# EAGLE design hemera_C (EAGLE 5.10)
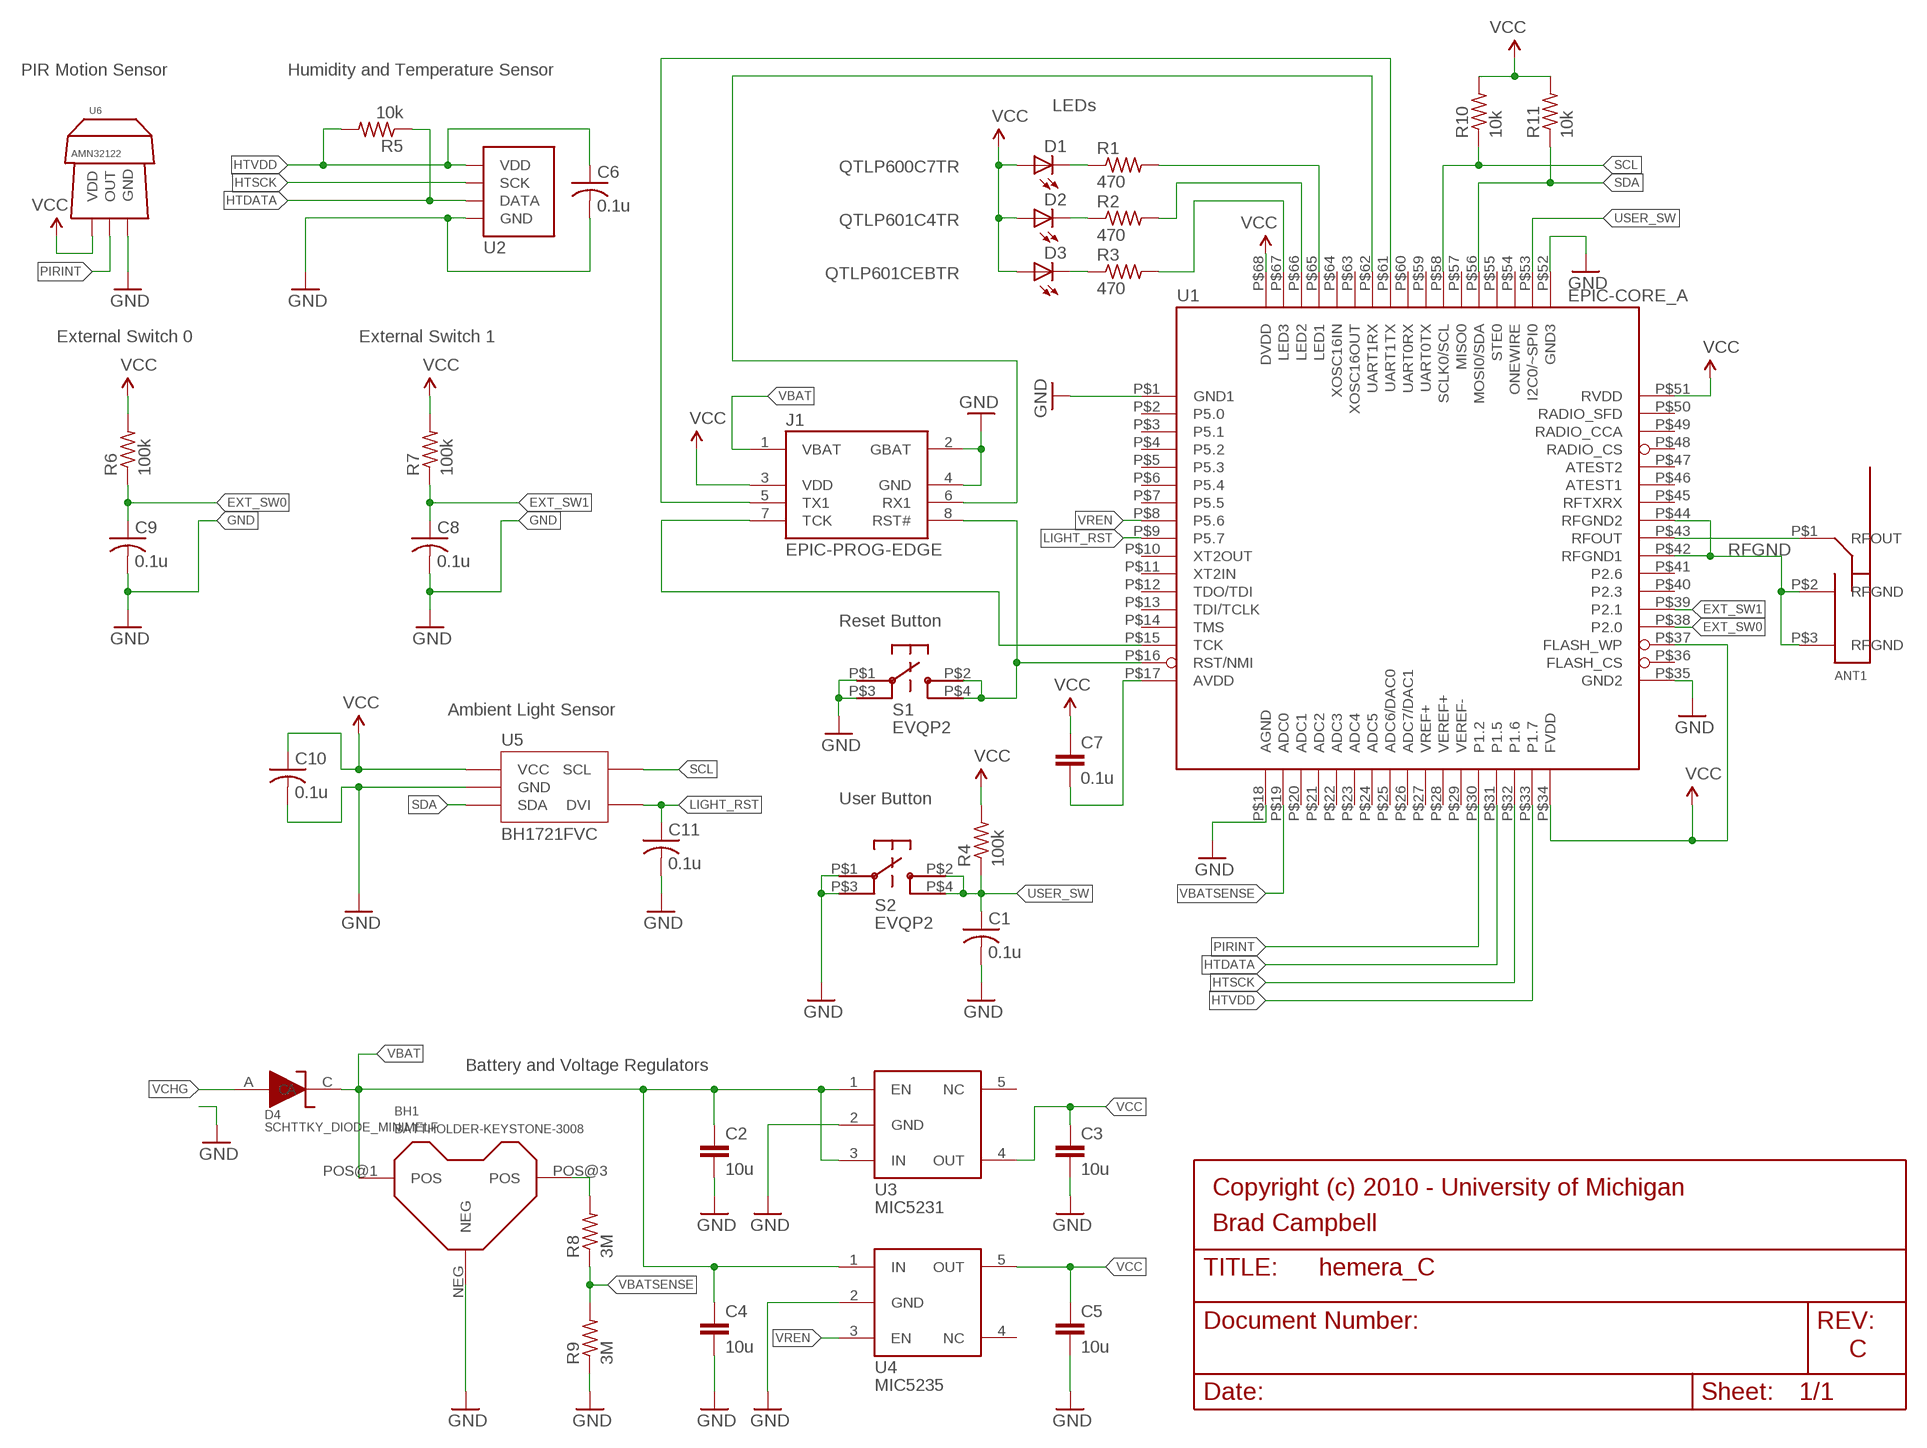
[diagram p0: schematic, sheet 1]

## Parts
ANT1  PIFA-2.4GHZ  [PIFA-2.4GHZ]
BH1  BATTHOLDER-KEYSTONE-3008  [BATTHOLDER-KEYSTONE-3008]
C1  0.1u  C-USC0603  [C0603]
C2  10u  C-EUC0603  [C0603]
C3  10u  C-EUC0603  [C0603]
C4  10u  C-EUC0603  [C0603]
C5  10u  C-EUC0603  [C0603]
C6  0.1u  C-USC0603  [C0603]
C7  0.1u  C-EUC0603  [C0603]
C8  0.1u  C-USC0603  [C0603]
C9  0.1u  C-USC0603  [C0603]
C10  0.1u  C-USC0603  [C0603]
C11  0.1u  C-USC0603  [C0603]
D1  QTLP600C7TR  LED0603  [LED-0603]
D2  QTLP601C4TR  LED0603  [LED-0603]
D3  QTLP601CEBTR  LED0603  [LED-0603]
D4  SCHTTKY_DIODE_MINIMELF  [SCHOTTKY_DIODE_MINIMELF]
J1  EPIC-PROG-EDGE  [EPIC-PROG-EDGE]
R1  470  R-US_R0603  [R0603]
R2  470  R-US_R0603  [R0603]
R3  470  R-US_R0603  [R0603]
R4  100k  R-US_R0603  [R0603]
R5  10k  R-US_R0603  [R0603]
R6  100k  R-US_R0603  [R0603]
R7  100k  R-US_R0603  [R0603]
R8  3M  R-US_R0603  [R0603]
R9  3M  R-US_R0603  [R0603]
R10  10k  R-US_R0603  [R0603]
R11  10k  R-US_R0603  [R0603]
S1  EVQP2  [EVQP2]
S2  EVQP2  [EVQP2]
U1  EPIC-CORE_A  [EPIC-LCC68]
U2  SHT1XSMD  [SHT1X]
U3  MIC5231  [SOT23-5]
U4  MIC5235  [SOT23-5]
U5  BH1721FVC  [WSOF5]
U6  AMN32122  [PIR]

## Nets
EXT_SW0: C9.1 R6.1 U1.P$38(P2.0)
EXT_SW1: C8.1 R7.1 U1.P$39(P2.1)
GND: BH1.NEG C1.2 C2.2 C3.2 C4.2 C5.2 C6.2 C8.2 C9.2 C10.2 C11.2 J1.2(GBAT) J1.4(GND) R9.1 S1.P$1 S1.P$3 S2.P$1 S2.P$3 U1.P$1(GND1) U1.P$18(AGND) U1.P$35(GND2) U1.P$52(GND3) U2.1(GND) U3.2(GND) U4.2(GND) U5.GND U6.GND
HTDATA: R5.1 U1.P$31(P1.5) U2.2(DATA)
HTSCK: U1.P$32(P1.6) U2.3(SCK)
HTVDD: C6.1 R5.2 U1.P$33(P1.7) U2.4(VDD)
LIGHT_RST: C11.1 U1.P$9(P5.7) U5.DVI
N$1: ANT1.P$1(RFOUT) U1.P$43(RFOUT)
N$2: C7.2 U1.P$17(AVDD)
N$4: J1.7(TCK) U1.P$15(TCK)
N$5: J1.5(TX1) U1.P$61(UART1TX)
N$6: D1.C R1.1
N$7: D2.C R2.1
N$8: D3.C R3.1
N$9: R1.2 U1.P$65(LED1)
N$10: R2.2 U1.P$66(LED2)
N$11: R3.2 U1.P$67(LED3)
N$13: J1.6(RX1) U1.P$62(UART1RX)
N$16: BH1.POS@3(POS) R8.2
N$27: J1.8(RST#) S1.P$2 S1.P$4 U1.P$16(RST/NMI)
PIRINT: U1.P$30(P1.2) U6.OUT
RFGND: ANT1.P$2(RFGND) ANT1.P$3(RFGND) U1.P$42(RFGND1) U1.P$44(RFGND2)
SCL: R10.1 U1.P$58(SCLK0/SCL) U5.SCL
SDA: R11.1 U1.P$56(MOSI0/SDA) U5.SDA
USER_SW: C1.1 R4.1 S2.P$2 S2.P$4 U1.P$53(I2C0/~SPI0)
VBAT: BH1.POS@1(POS) C2.1 C4.1 D4.C J1.1(VBAT) U3.1(EN) U3.3(IN) U4.1(IN)
VBATSENSE: R8.1 R9.2 U1.P$19(ADC0)
VCC: C3.1 C5.1 C7.1 C10.1 D1.A D2.A D3.A J1.3(VDD) R4.2 R6.2 R7.2 R10.2 R11.2 U1.P$34(FVDD) U1.P$37(FLASH_WP) U1.P$51(RVDD) U1.P$68(DVDD) U3.4(OUT) U4.5(OUT) U5.VCC U6.VDD
VCHG: D4.A
VREN: U1.P$8(P5.6) U4.3(EN)
Unconnected: U1.P$2(P5.0) U1.P$3(P5.1) U1.P$4(P5.2) U1.P$5(P5.3) U1.P$6(P5.4) U1.P$7(P5.5) U1.P$10(XT2OUT) U1.P$11(XT2IN) U1.P$12(TDO/TDI) U1.P$13(TDI/TCLK) U1.P$14(TMS) U1.P$20(ADC1) U1.P$21(ADC2) U1.P$22(ADC3) U1.P$23(ADC4) U1.P$24(ADC5) U1.P$25(ADC6/DAC0) U1.P$26(ADC7/DAC1) U1.P$27(VREF+) U1.P$28(VEREF+) U1.P$29(VEREF-) U1.P$36(FLASH_CS) U1.P$40(P2.3) U1.P$41(P2.6) U1.P$45(RFTXRX) U1.P$46(ATEST1) U1.P$47(ATEST2) U1.P$48(RADIO_CS) U1.P$49(RADIO_CCA) U1.P$50(RADIO_SFD) U1.P$54(ONEWIRE) U1.P$55(STE0) U1.P$57(MISO0) U1.P$59(UART0TX) U1.P$60(UART0RX) U1.P$63(XOSC16OUT) U1.P$64(XOSC16IN) U3.5(NC) U4.4(NC)

## Notes on the sheet
- PIR Motion Sensor | Humidity and Temperature Sensor
- LEDs
- External Switch 0 | External Switch 1
- Reset Button
- Ambient Light Sensor
- User Button
- Battery and Voltage Regulators
- Copyright (c) 2010 - University of Michigan
- Brad Campbell
- C

## Library data of the parts
ANT1 = berkeley-epic:PIFA-2.4GHZ
BH1 = berkeley-epic:BATTHOLDER-KEYSTONE-3008
C1 C6 C8-C11 = rcl:C-US: CAPACITOR, American symbol
C2-C5 C7 = rcl:C-EU: CAPACITOR, European symbol
D1-D3 = berkeley-epic:LED: LEDs Standard schematic elements and footprints for 5mm, 3mm, 1206, and 0603 sized LEDs. 5mm - Spark Fun Electronics SKU : COM-00529 (and others)
D4 = berkeley-epic:SCHTTKY_DIODE_MINIMELF
J1 = berkeley-epic:EPIC-PROG-EDGE
R1-R11 = rcl:R-US_: RESISTOR, American symbol
S1 S2 = berkeley-epic:EVQP2
U1 = berkeley-epic:EPIC-CORE_A
U2 = berkeley-epic:SHT1X: SHT1x Humdity Sensor Sensirion humdity sensor. Schematic element and footprint proven. Spark Fun Electronics SKU : COM-08227
U3 = berkeley-epic:MIC5231
U4 = berkeley-epic:MIC5235
U5 = brad:BH1721FVC: Digital output type ambient light sensor IC is composed of photodiodes, current-voltage converter circuit, A / D converter, control logic circuits, interface circuits and etc. It connects with I2C BUS in an equipment.
U6 = brad:AMN32122: PIR motion detector.

## Board
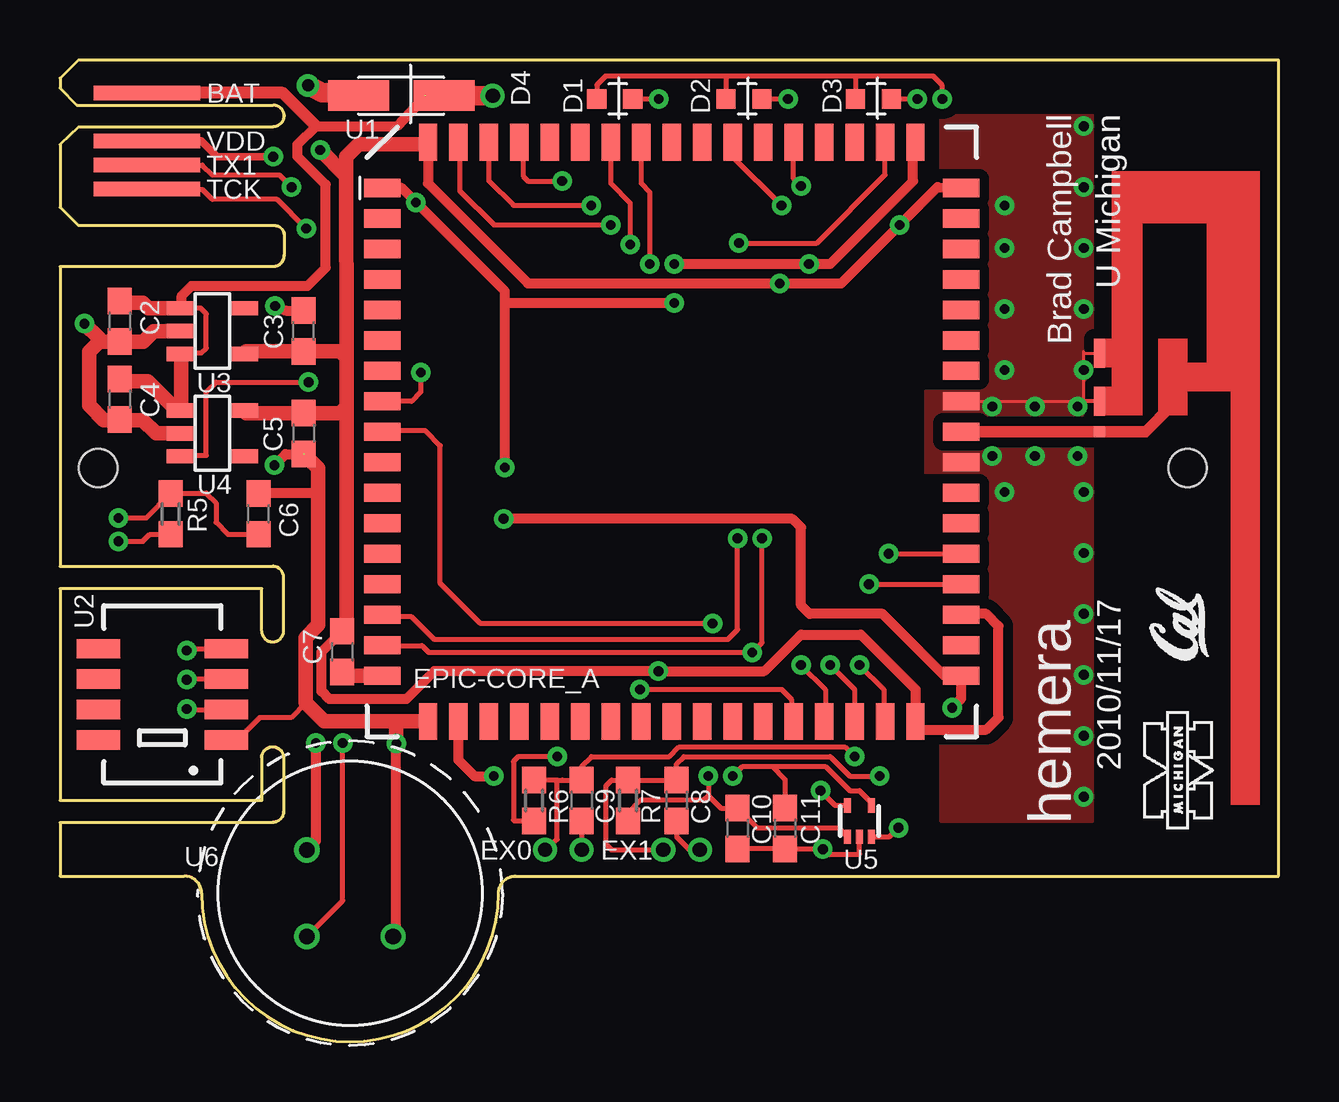
[diagram p1: board, top side]
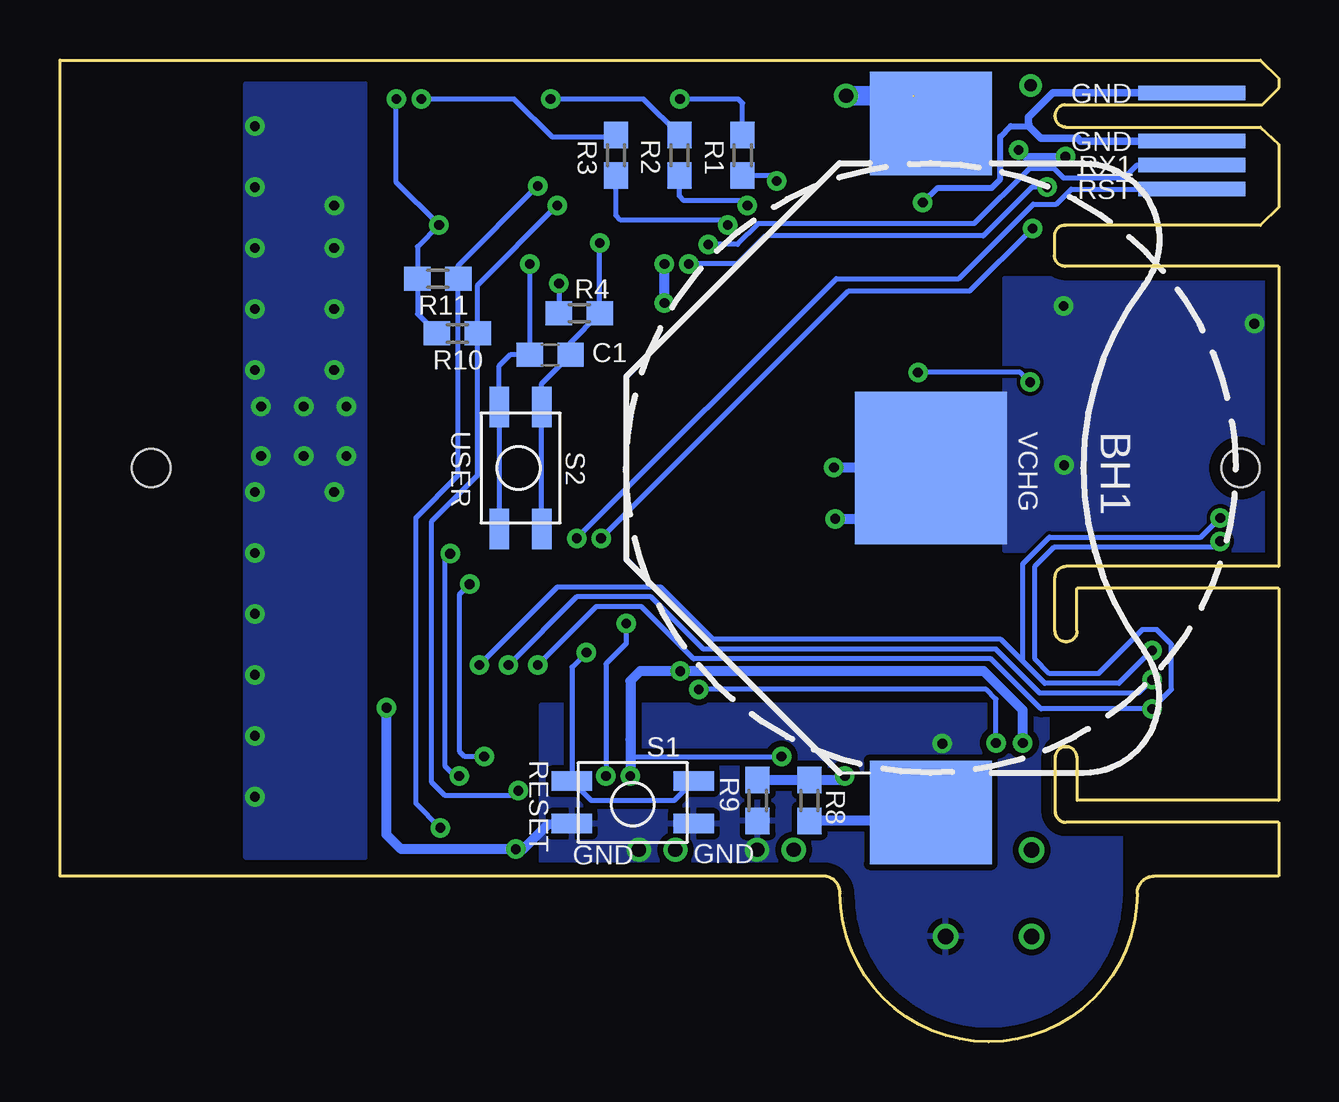
[diagram p2: board, bottom side, seen from below]

Size 50.8 x 40.91 mm. Coordinates in mm from the lower left corner, seen from the top.
Outline: 0,39.74 0.7,39.03 8.89,39.03
Outline: 8.89,39.04 arc-177 8.89,38.13 8.89,38.11 0.76,38.11 0,37.39 0,34.77 0.76,34.02 8.89,34.02 arc-90 9.35,33.63 9.35,32.79 arc-93 8.89,32.31 0,32.31 0,19.81 8.87,19.81 arc-90 9.32,19.36 9.32,17.12 arc-180 8.41,17.12 8.41,18.9 0,18.9 0,10.06 8.41,10.06 8.41,11.84 arc-180 9.32,11.84 9.32,9.6 arc-90 8.87,9.15 0,9.15 0,6.91 5.18,6.91 arc-90 5.9,6.19 arc180 18.28,6.19 arc-90 19,6.91 50.8,6.91 50.8,40.91 0.76,40.91 0,40.16 0,39.75
Copper layers (1*16): Top 0.0178mm / dielectric 1.4986mm / Bottom 0.0178mm
Design rules "SSC-EAGLE-2Lyr_v1.0.0.3 *": minimum track width 6mil, minimum drill 14mil, track to track 6mil, track to pad 6mil, pad to pad 6mil, via to via 6mil, smd to smd 6mil, copper to edge 20mil, drill to drill 16mil, minimum pad ring 8mil, minimum via ring 8mil, stop-mask expansion 3mil, vias tented up to drill 17mil, thermal gap 10mil
Holes 1.6 mm at 1.59,23.91 47,23.91

### Footprints (pad centres in the part's own frame; a part is rotated, then mirrored left to right if it is on the bottom)
PIFA-2.4GHZ = smd 0.46 x 0.46: P$1 -2.65,-1.495 | smd 0.46 x 1.2: P$2 -2.655,1.785; P$3 -2.65,-0.215
BATTHOLDER-KEYSTONE-3008 = smd 6.35 x 6.35: NEG 0,0 | smd 4.318 x 5.08: POS@1 -14.351,0; POS@3 14.351,0
C0603 = smd 1.1 x 1: 1 -0.85,0; 2 0.85,0
LED-0603 = smd 0.8 x 0.8: A 0,-0.75; C 0,0.75
SCHOTTKY_DIODE_MINIMELF = smd 2.54 x 1.27: A -1.778,0; C 1.778,0
EPIC-PROG-EDGE = smd 0.61 x 4.445: 1 -1.001,3.619; 3 1.001,3.619; 5 2.002,3.619; 7 3.002,3.619 | smd 0.61 x 4.445 bottom: 2 -1.001,3.619; 4 1.001,3.619; 6 2.002,3.619; 8 3.002,3.619
R0603 = smd 1.1 x 1: 1 -0.85,0; 2 0.85,0
EVQP2 = smd 1.676 x 0.813: P$1 -2.54,-0.87; P$2 -2.54,0.908; P$3 2.54,-0.87; P$4 2.54,0.908
EPIC-LCC68 = smd 1.524 x 0.762: P$1 -12.065,10.16; P$2 -12.065,8.89; P$3 -12.065,7.62; P$4 -12.065,6.35; P$5 -12.065,5.08; P$6 -12.065,3.81; P$7 -12.065,2.54; P$8 -12.065,1.27; P$9 -12.065,0; P$10 -12.065,-1.27; P$11 -12.065,-2.54; P$12 -12.065,-3.81; P$13 -12.065,-5.08; P$14 -12.065,-6.35; P$15 -12.065,-7.62; P$16 -12.065,-8.89; P$17 -12.065,-10.16; P$35 12.065,-10.16; P$36 12.065,-8.89; P$37 12.065,-7.62; P$38 12.065,-6.35; P$39 12.065,-5.08; P$40 12.065,-3.81; P$41 12.065,-2.54; P$42 12.065,-1.27; P$43 12.065,0; P$44 12.065,1.27; P$45 12.065,2.54; P$46 12.065,3.81; P$47 12.065,5.08; P$48 12.065,6.35; P$49 12.065,7.62; P$50 12.065,8.89; P$51 12.065,10.16 | smd 0.762 x 1.524: P$18 -10.16,-12.065; P$19 -8.89,-12.065; P$20 -7.62,-12.065; P$21 -6.35,-12.065; P$22 -5.08,-12.065; P$23 -3.81,-12.065; P$24 -2.54,-12.065; P$25 -1.27,-12.065; P$26 0,-12.065; P$27 1.27,-12.065; P$28 2.54,-12.065; P$29 3.81,-12.065; P$30 5.08,-12.065; P$31 6.35,-12.065; P$32 7.62,-12.065; P$33 8.89,-12.065; P$34 10.16,-12.065; P$52 10.16,12.065; P$53 8.89,12.065; P$54 7.62,12.065; P$55 6.35,12.065; P$56 5.08,12.065; P$57 3.81,12.065; P$58 2.54,12.065; P$59 1.27,12.065; P$60 0,12.065; P$61 -1.27,12.065; P$62 -2.54,12.065; P$63 -3.81,12.065; P$64 -5.08,12.065; P$65 -6.35,12.065; P$66 -7.62,12.065; P$67 -8.89,12.065; P$68 -10.16,12.065
SHT1X = smd 1.8 x 0.8: 1 -2.667,1.905; 2 -2.667,0.635; 3 -2.667,-0.635; 4 -2.667,-1.905; 5 2.667,-1.905; 6 2.667,-0.635; 7 2.667,0.635; 8 2.667,1.905
SOT23-5 = smd 0.6 x 1.2: 1 -0.95,-1.306; 2 0,-1.306; 3 0.95,-1.306; 4 0.95,1.306; 5 -0.95,1.306
WSOF5 = smd 0.3 x 0.6: DVI 0.5,0.65; GND 0,-0.65; SCL -0.5,0.65; SDA 0.5,-0.65; VCC -0.5,-0.65
PIR = drill 0.65 round: GND -1.796,1.796; OUT 1.796,1.796; VDD 1.796,-1.796

### Placement (x,y rotation side)
ANT1  45.97,26.91 0 top
BH1  14.5,23.91 270 bottom
C1  30.37,28.63 180 bottom
C2  2.49,30.02 270 top
C3  10.16,29.62 90 top
C4  2.49,26.77 270 top
C5  10.16,25.35 270 top
C6  8.28,22 90 top
C7  11.76,16.26 270 top
C8  25.7,10.06 270 top
C9  21.74,10.06 270 top
C10  28.24,8.89 270 top
C11  30.23,8.89 270 top
D1  23.13,39.28 270 top
D2  28.52,39.28 270 top
D3  33.91,39.28 270 top
D4  14.22,39.42 0 top
J1  0,38.54 270 top
R1  22.34,36.94 270 bottom
R2  24.98,36.94 270 bottom
R3  27.63,36.94 270 bottom
R4  29.15,30.35 180 bottom
R5  4.62,22 90 top
R6  19.76,10.06 270 top
R7  23.67,10.06 270 top
R8  19.56,10.06 270 bottom
R9  21.72,10.06 90 bottom
R10  34.24,29.52 180 bottom
R11  35.05,31.8 180 bottom
S1  26.92,9.96 0 bottom
S2  31.63,23.91 270 bottom
U1  25.5,25.42 0 top
U2  4.27,14.48 180 top
U3  6.35,29.62 270 top
U4  6.35,25.35 270 top
U5  33.32,9.2 0 top
U6  12.09,6.19 180 top
U$1  [UMICH]  48.26,8.79 90 top
U$3  [CAL1]  48.26,15.8 90 top

### Tracks (layer width: path | path; a pad name or v marks a point on that pad's centre or on a via)
EXT_SW0  (via drill 0.41, 0.41 pad 0.79, 0.6)
  Top 0.203: v33.72,19.07 U1.P$38 | v33.12,11.89 32.72,12.29 25.81,12.29 25.4,11.89 22.15,11.89 21.74,11.48 C9.1 20.93,10.91 20.73,10.91 | 20.73,10.91 R6.1 | v20.22,8 20.3,8 20.73,8.43 20.73,10.91
  Bottom 0.203: v33.72,19.07 34.14,18.65 34.14,12.09 33.93,11.89 v33.12,11.89
EXT_SW1  (via drill 0.41, 0.41 pad 0.79, 0.6)
  Top 0.203: v34.54,20.34 U1.P$39 | v34.16,11.08 32.92,11.08 32.11,11.89 26.01,11.89 25.7,11.58 C8.1 R7.1 23,10.91 22.76,10.67 22.76,8.23 22.99,8 v25.15,8
  Bottom 0.203: v34.54,20.34 34.75,20.13 34.75,11.48 34.34,11.08 v34.16,11.08
GND  (via drill 0.41, 0.41 pad 0.79, 0.6)  (1 unrouted)
  Top 0.203: U5.GND 33.33,7.82 32,7.82 v31.8,8.03 31.79,8.04 C11.2 C10.2 | C8.2 25.7,8.54 26.24,8 v26.67,8 | C9.2 v21.74,8 | U2.1 7.39,12.57 8.33,13.51 9.63,13.51 10.24,14.12
  Top 0.406: U3.2 4.94,29.52 | 10.77,22.61 10.73,22.64 | U1.P$52 35.56,37.38 35.56,35.87 32.11,32.41 v31.22,32.41 v25.6,32.41 | v37.19,13.92 37.56,14.3 U1.P$35 36.86,15.26 34.29,17.83 31.24,17.83 30.89,18.19 30.89,21.44 30.53,21.79 v18.49,21.79 | v18.54,23.93 18.54,30.79 | 18.54,30.79 18.54,31.27 v14.83,34.98 14.23,35.58 U1.P$1 | C3.2 9.41,30.47 v8.97,30.66 | v8.94,24.03 9.4,24.49 10.16,24.49 | 18.54,30.79 v25.6,30.79 | C6.2 8.28,22.86 10.77,22.86 | U6.GND 14.02,4.53 v14.02,12.42
  Top 0.61: C5.2 10.77,23.89 10.77,22.86 10.77,22.61 10.77,17.38 10.24,16.84 10.24,14.12 11.01,13.35 14.02,13.35 | U4.2 4.01,25.35 3.45,25.91 2.5,25.91 | C4.2 2.5,25.91 | 2.5,25.91 1.83,25.91 1.22,26.52 1.22,28.75 1.63,29.16 | 1.63,29.16 2.48,29.16 C2.2 3.47,29.17 3.91,29.62 U3.2 | 1.63,29.16 1.63,29.31 v1.02,29.92 | 14.02,13.35 U1.P$18 | v14.02,12.42 14.02,13.35
  Bottom 0.203: S2.P$3 S2.P$1 32.51,26.47 32.51,28.14 32.03,28.63 C1.2 v31.22,32.41
  Bottom 0.254: v14.83,34.98 14.2,35.59 11.96,35.59 11.61,35.94 11.61,37.72 11.18,38.15 10.41,38.15
  Bottom 0.305: J1.2 9.41,39.54 10.43,38.52 10.43,38.39 10.41,38.15 9.91,37.64 8.38,37.64 8.27,37.53 J1.4
  Bottom 0.406: v18.54,23.93 14.48,23.93 BH1.NEG 16.62,21.79 v18.49,21.79 | v25.6,30.79 v25.6,32.41 | v37.19,13.92 37.19,8.64 36.58,8.03 v31.8,8.03 31.5,8.03 30.46,9.06 S1.P$1
  pour Bottom (isolate 0.254): 9.65,8.84 9.65,14.02 30.75,14.02 30.75,7.42 18.82,7.42 arc90 17.59,6.19 arc-180 6.59,6.19 6.59,8.84
  pour Bottom (isolate 0.127, no thermals): 0.51,20.47 0.51,31.8 11.43,31.8 11.43,20.47
HTDATA  (via drill 0.41)
  Top 0.203: U1.P$31 31.9,13.41 31.9,14.68 v30.89,15.7 | U2.2 5.31,13.84 v5.28,13.87 | R5.1 3.75,21.15 3.45,20.85 v2.44,20.85
  Bottom 0.203: v30.89,15.7 28.45,18.14 26.57,18.14 24.38,15.95 11.99,15.95 9.91,13.87 v5.28,13.87 4.47,14.68 4.47,16.56 5.08,17.17 5.69,17.17 7.52,15.34 9.55,15.34 10.16,15.95 10.16,19.81 9.35,20.63 2.67,20.63 v2.44,20.85
HTSCK  (via drill 0.41)
  Top 0.203: U1.P$32 33.12,14.68 v32.11,15.7 | U2.3 5.31,15.11 v5.28,15.09
  Bottom 0.203: v32.11,15.7 29.26,18.54 26.16,18.54 23.98,16.36 11.79,16.36 9.96,14.53 5.84,14.53 v5.28,15.09
HTVDD  (via drill 0.41)
  Top 0.203: U1.P$33 34.34,13.4 34.34,14.68 v33.33,15.7 | U2.4 5.36,16.38 v5.28,16.31 | C6.1 7,21.15 6.5,21.64 6.5,22.45 6.1,22.86 4.64,22.86 R5.2 3.61,21.83 v2.44,21.83
  Bottom 0.203: v33.33,15.7 30.07,18.95 25.76,18.95 23.57,16.77 11.58,16.77 10.67,15.85 | 10.67,15.85 9.75,14.94 6.66,14.94 v5.28,16.31 | 10.67,15.85 10.67,19.91 9.55,21.03 3.24,21.03 v2.44,21.83
LIGHT_RST  (via drill 0.41)
  Top 0.203: U1.P$9 13.47,25.45 15.24,25.45 15.85,24.84 15.85,19.1 17.52,17.43 v27.2,17.43 | U5.DVI 33.83,9.97 33.33,10.47 32.92,10.47 31.9,11.48 29.67,11.48 | 29.67,11.48 28.45,11.48 v28.04,11.08 | C11.1 30.23,10.92 29.67,11.48
  Bottom 0.203: v27.2,17.43 27.2,16.59 28.04,15.75 v28.04,11.08
N$1
  Top 0.406: 43.31,25.42 43.31,25.39 | 43.31,25.42 ANT1.P$1 | 43.31,25.42
  Top 0.47: U1.P$43 43.31,25.42
N$2
  Top 0.61: U1.P$17 11.91,15.26 C7.2
N$4  (via drill 0.41)
  Top 0.203: v10.26,33.88 9.04,35.1 6.35,35.1 5.94,35.51 3.62,35.51 J1.7 | U1.P$15 13.5,17.73 14.63,17.73 15.6,16.77 27.84,16.77 28.25,17.17 v28.25,20.98
  Bottom 0.203: v10.26,33.88 12.88,31.29 17.93,31.29 v28.25,20.98
N$5  (via drill 0.41)
  Top 0.203: U1.P$61 24.23,35.77 24.59,35.41 v24.59,32.41 | J1.5 5.94,36.53 6.35,36.12 9.14,36.12 v9.65,35.61
  Bottom 0.203: v9.65,35.61 10.29,35.61 12.32,33.58 21.39,33.58 22.55,32.41 v24.59,32.41
N$6  (via drill 0.41)
  Top 0.203: v24.96,39.28 D1.C
  Bottom 0.203: v24.96,39.28 22.52,39.28 22.35,39.12 22.35,37.8 R1.1
N$7  (via drill 0.41)
  Top 0.203: v30.35,39.28 D2.C
  Bottom 0.203: v30.35,39.28 26.48,39.28 R2.1
N$8  (via drill 0.41)
  Top 0.203: v35.74,39.28 D3.C
  Bottom 0.203: v35.74,39.28 31.87,39.28 30.28,37.7 27.72,37.7 R3.1
N$9  (via drill 0.41)
  Top 0.203: v20.93,35.87 19.51,35.87 19.3,36.07 19.3,37.33 U1.P$65
  Bottom 0.203: R1.2 21.16,36.09 v20.93,35.87
N$10  (via drill 0.41)
  Top 0.203: v22.15,34.85 18.9,34.85 17.88,35.87 U1.P$66
  Bottom 0.203: R2.2 24.98,35.25 24.79,35.05 22.35,35.05 v22.15,34.85
N$11  (via drill 0.41)
  Top 0.203: U1.P$67 16.66,37.43 16.66,35.46 18.09,34.04 v22.96,34.04
  Bottom 0.203: R3.2 27.63,34.43 27.43,34.24 23.16,34.24 v22.96,34.04
N$13  (via drill 0.41)
  Top 0.203: U1.P$62 22.96,35.77 23.77,34.95 v23.77,33.23
  Bottom 0.203: J1.6 5.91,36.53 6.45,35.99 8.97,35.99 9.36,36.39 10.4,36.39 12.7,34.09 21.69,34.09 22.55,33.23 v23.77,33.23
N$16
  Bottom 0.406: R8.2 14.85,9.21 BH1.POS@3
N$27  (via drill 0.41)
  Top 0.203: U1.P$16 13.46,16.56 13.51,16.51 15.09,16.51 15.37,16.22 v28.85,16.22 29.26,16.63 v29.26,20.98
  Bottom 0.203: J1.8 5.52,35.53 5.68,35.5 5.78,35.53 8.65,35.53 9.27,34.9 10.24,34.9 13.34,31.8 18.44,31.8 v29.26,20.98 | v28.85,16.22 29.46,15.61 S1.P$2 28.66,10.06 25.19,10.06 S1.P$4
PIRINT  (via drill 0.41)
  Top 0.203: U1.P$30 30.48,13.45 30.48,14.28 30.07,14.68 v24.18,14.68 | U6.OUT 11.79,5.89 v11.79,12.45
  Bottom 0.203: v24.18,14.68 12.19,14.68 11.79,14.28 v11.79,12.45
RFGND  (via drill 0.41)
  Top 0.127: 42.67,28.7 ANT1.P$2 | 42.67,28.7 42.67,28.75 | 42.67,28.7 v42.67,27.99 42.67,26.72 43.43,26.72 43.43,26.7 ANT1.P$3 37.59,26.7 37.59,26.72 | 37.59,24.15 37.59,24.18 | U1.P$42 37.59,24.15 | 37.59,24.15 37.59,24.12
  other vias: 39.37,33.07 39.37,34.85 39.37,30.53 39.37,27.99 42.67,35.61 42.67,33.07 42.67,30.53 38.86,26.47 40.64,26.47 42.42,26.47 38.86,24.41 40.64,24.41 42.42,24.41 42.67,22.91 39.37,22.91 42.67,20.37 42.67,17.83 42.67,15.29 42.67,12.75 42.67,10.21 42.67,38.15
  pour Top (isolate 0.406, no thermals): 43.05,9.2 43.05,38.6 36.7,38.6 36.7,27.1 36.07,27.1 36.07,23.73 36.7,23.73 36.7,9.2
  pour Bottom: 43.05,7.67 43.05,39.93 38.1,39.93 38.1,7.67
SCL  (via drill 0.41)
  Top 0.203: U1.P$58 28.04,36.88 v30.07,34.85 | U5.SCL 32.32,9.85 v31.7,10.47
  Bottom 0.203: v30.07,34.85 33.39,31.54 R10.1 33.39,23.61 35.31,21.69 35.31,10.82 34.75,10.26 31.9,10.26 v31.7,10.47
SDA  (via drill 0.41)
  Top 0.203: U1.P$56 30.58,35.97 v30.89,35.66 | U5.SDA 34.58,8.55 v34.95,8.92
  Bottom 0.203: v30.89,35.66 34.2,32.35 R11.1 34.2,23.61 35.97,21.85 35.97,9.93 v34.95,8.92
USER_SW  (via drill 0.41)
  Top 0.203: U1.P$53 34.39,36.12 31.55,33.28 v28.3,33.28
  Bottom 0.203: S2.P$4 S2.P$2 30.72,27.43 C1.1 29.52,29.13 R4.1 v28.3,33.28
VBAT  (via drill 0.6)  (1 unrouted)
  Top 0.203: U3.1 5.86,30.57 6.1,30.33 6.1,28.91 5.89,28.7 5.08,28.7 U3.3
  Top 0.406: 15.24,39.42 14.05,38.15 10.67,38.15 9.91,37.39 9.91,36.88 11.07,35.71 11.07,32.26 10.31,31.5 5.49,31.5 5.08,31.09 5.08,30.6 U3.1
  Top 0.508: J1.1 9.28,39.54 10.67,38.15
  Top 0.61: U3.3 U4.1 4.89,26.3 3.66,27.54 2.58,27.54 C4.1 | U3.1 3.67,30.57 3.45,30.79 2.58,30.79 C2.1
  Top 0.813: v18.03,39.42 D4.C
  Bottom 0.406: BH1.POS@1 14.5,39.15 14.48,39.17 14.73,39.42
  Bottom 0.61: BH1.POS@1 14.5,38.73 15.19,39.42
  Bottom 0.813: 14.73,39.42 15.19,39.42 v18.03,39.42
VBATSENSE  (via drill 0.41)
  Top 0.406: U1.P$19 16.61,11.74 17.27,11.08 v18.09,11.08
  Bottom 0.406: R9.2 R8.1 18.25,10.91 v18.09,11.08
VCC  (via drill 0.41)
  Top 0.203: 11.94,36.45 11.91,36.09 | 27.77,40.23 22.73,40.23 22.38,39.88 D1.A | v36.78,39.28 36.78,39.85 36.4,40.23 33.16,40.23 | 33.16,40.23 D3.A | 27.77,40.23 D2.A | 33.16,40.23 27.77,40.23 | U5.VCC 32.45,8.92 29.07,8.92 C10.1 27.55,9.74 27.03,10.26 | v27.03,11.08 27.03,10.26 | 27.03,10.26 26.82,10.06 24.18,10.06 23.67,9.55 R7.2 | R6.2 18.93,9.21 18.9,9.25 18.9,11.69 19.1,11.89 v20.73,11.89
  Top 0.305: J1.3 5.89,37.54 6.56,36.87 v8.89,36.88 | 37.59,17.83 U1.P$37
  Top 0.406: 11.94,36.87 11.94,36.88 | 15.24,37.39 15.29,37.49 15.3,37.48 U1.P$68 15.34,35.77 19.51,31.6 v30,31.6 32.56,31.6 v35,34.04 36.58,35.61 U1.P$51 | U1.P$37 37.56,17.83 37.59,17.83 38.61,17.83 39.12,17.32 39.12,13.51 38.61,13.01 35.69,13.01 35.69,13.32 U1.P$34 35.66,14.68 33.38,16.97 30.89,16.97 29.36,15.44 v24.94,15.44 15.6,15.44 14.43,14.28 11.23,14.28 10.9,14.61 10.9,16.24 C7.1 | U6.VDD 10.67,8.36 v10.67,12.45
  Top 0.61: 11.94,36.88 12.45,37.39 15.24,37.39 | 11.94,26.47 11.94,20.37 11.94,17.36 C7.1 | 11.94,26.47 11.94,28.5 | 11.94,28.5 11.94,36.45 11.94,36.87 | 11.91,36.09 v10.85,37.16 | 11.94,26.47 11.67,26.2 C5.1 7.76,26.2 U4.5 | 11.94,28.5 11.67,28.77 C3.1 7.76,28.77 U3.4
  Bottom 0.203: v36.78,39.28 36.78,35.82 v35,34.04 35.9,33.14 R11.2 35.9,30.33 R10.2 | v30,31.6 R4.2 | v20.73,11.89 27.03,11.89 27.03,12.6
  Bottom 0.305: v10.85,37.16 10.57,36.88 v8.89,36.88
  Bottom 0.406: v27.03,11.08 27.03,12.6 27.03,15.04 26.62,15.44 v24.94,15.44 12.29,15.44 10.67,13.82 v10.67,12.45
VCHG  (via drill 0.51 pad 0.94)
  Top 0.305: 12.32,39.55 D4.A 12.45,39.3
  Top 0.813: 12.32,39.55 10.92,39.55 v10.34,39.85
VREN  (via drill 0.41)
  Top 0.203: U1.P$8 14.65,26.69 15.04,27.08 v15.04,27.89 | U4.3 5.08,24.44 6.1,24.44 6.1,27.08 6.5,27.48 v10.36,27.48
  Bottom 0.203: v15.04,27.89 10.77,27.89 v10.36,27.48

### Text on the board
tPlace: Brad Campbell | U Michigan | 2010/11/17 | hemera | EX0 | EX1
bPlace: VCHG | USER | RESET | GND | GND